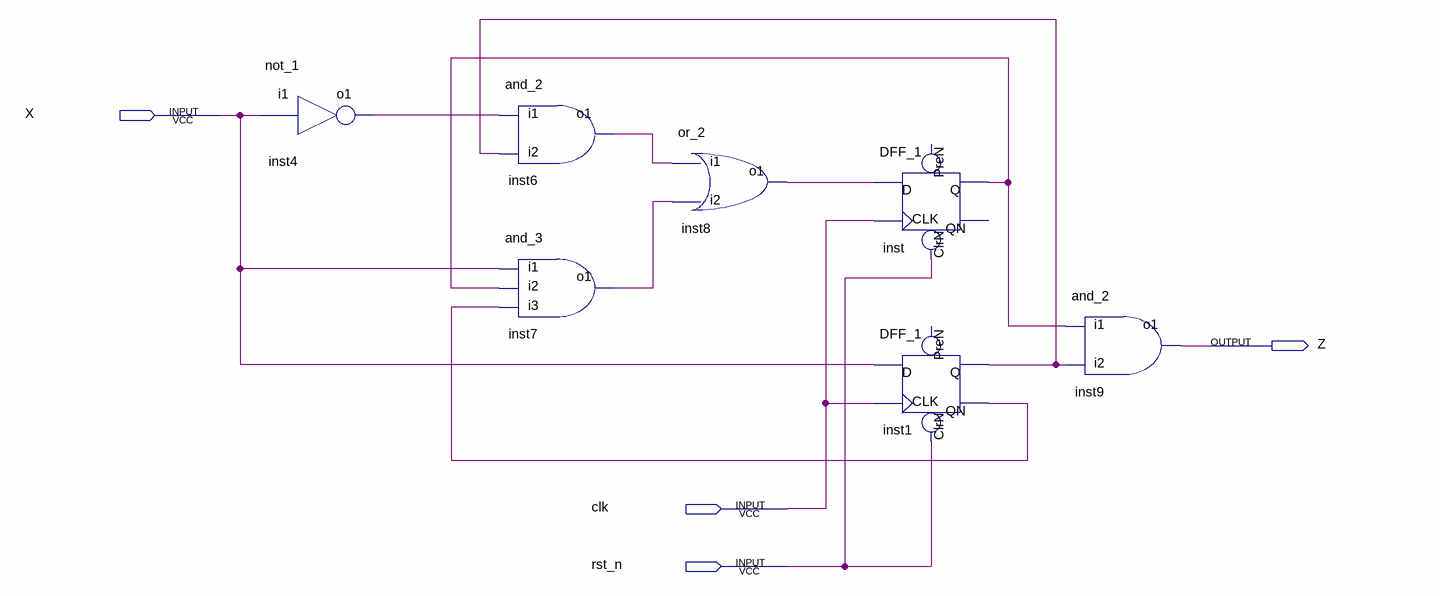
[diagram p0: schematic sheet]
// Quartus schematic SD101.bdf as structural Verilog: 7 symbols, 4 pins
module SD101 (
  input  X,
  input  clk,
  input  rst_n,
  output Z
);

  wire inst1_q, inst1_qn, inst4_o1, inst6_o1, inst7_o1, inst8_o1, inst_q;

  not_1 inst4 (.i1(X), .o1(inst4_o1));
  and_2 inst6 (.i1(inst4_o1), .i2(inst1_q), .o1(inst6_o1));
  and_3 inst7 (.i1(X), .i2(inst_q), .i3(inst1_qn), .o1(inst7_o1));
  or_2 inst8 (.i1(inst6_o1), .i2(inst7_o1), .o1(inst8_o1));
  DFF_1 inst (.CLK(clk), .D(inst8_o1), .ClrN(rst_n), .Q(inst_q));  // open: PreN, QN
  DFF_1 inst1 (.CLK(clk), .D(X), .ClrN(rst_n), .QN(inst1_qn), .Q(inst1_q));  // open: PreN
  and_2 inst9 (.i1(inst_q), .i2(inst1_q), .o1(Z));
endmodule
